# Altium schematic sheet MAX232Breakout.SchDoc
size A
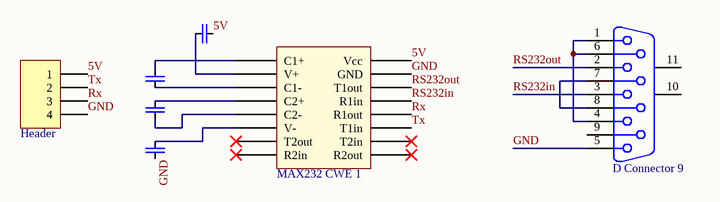
[diagram p0: MAX232Breakout.SchDoc]

## Parts
Header  Header 4  [HDR1X4]  (value not drawn)
J1  D Connector 9  [DSUB1.385-2H9]
MAX232_CWE_1  MAX232 CWE  [16pin SOIC]  (value not drawn)
SMD_1206_1  SMD 1206  [SMD 1206]  (value not drawn)
SMD_1206_2  SMD 1206  [SMD 1206]  (value not drawn)
SMD_1206_3  SMD 1206  [SMD 1206]  (value not drawn)
SMD_1206_4  SMD 1206  [SMD 1206]  (value not drawn)

## Nets
5V: Header.1 MAX232_CWE_1.16(Vcc) SMD_1206_1.2
GND: Header.4 J1.5 MAX232_CWE_1.15(GND) SMD_1206_3.1
RS232in: J1.3 MAX232_CWE_1.13(R1in)
RS232out: J1.2 MAX232_CWE_1.14(T1out)
Rx: Header.3 MAX232_CWE_1.12(R1out)
Tx: Header.2 MAX232_CWE_1.11(T1in)
NetJ1_1: J1.1 J1.4 J1.6
NetJ1_7: J1.7 J1.8
NetMAX232_CWE_1_1: MAX232_CWE_1.1(C1+) SMD_1206_2.2
NetMAX232_CWE_1_2: MAX232_CWE_1.2(V+) SMD_1206_1.1
NetMAX232_CWE_1_3: MAX232_CWE_1.3(C1-) SMD_1206_2.1
NetMAX232_CWE_1_4: MAX232_CWE_1.4(C2+) SMD_1206_4.2
NetMAX232_CWE_1_5: MAX232_CWE_1.5(C2-) SMD_1206_4.1
NetMAX232_CWE_1_6: MAX232_CWE_1.6(V-) SMD_1206_3.2

Not connected (* = marked no-connect by the designer): J1 9 10(MH1) 11(MH2); MAX232_CWE_1 7(T2out)* 8(R2in)* 9(R2out)* 10(T2in)*

## Library data of the parts
Header = Header 4: Header, 4-Pin; LatestRevisionDate: 17-Jul-2002; LatestRevisionNote: Re-released for DXP Platform.; Publisher: Altium Limited
J1 = D Connector 9: Receptacle Assembly, 9 Position, Right Angle; PackageDocument: O; Positions: 9; Published: 15-Jun-2001; LatestRevisionDate: 17-Jul-2002; LatestRevisionNote: Re-released for DXP Platform.; DatasheetDocument: 1-Sep-1999; PackageReference: 788750; Publisher: Altium Limited; Orientation: Right Angle; Gender: Receptacle
SMD_1206_1-SMD_1206_4 = SMD 1206: SMD 1206 Package Type